# EAGLE design led-strip (EAGLE 9.2.0)
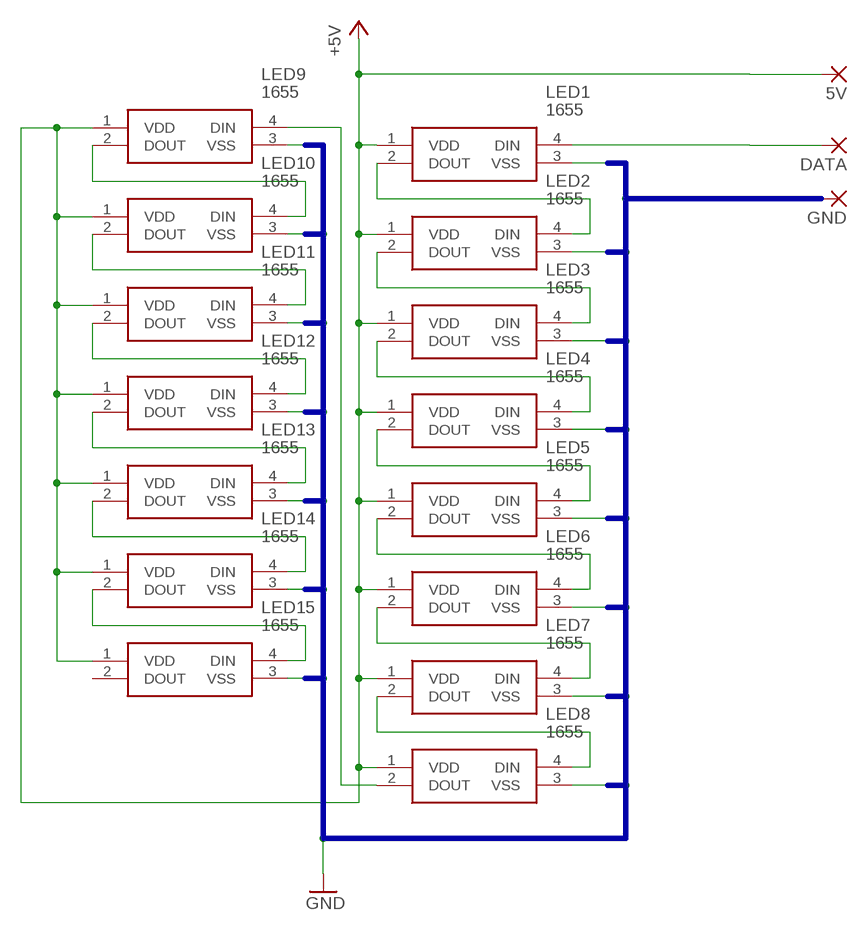
[diagram p0: schematic, sheet 1]

## Parts
5V  1,6/0,8  [1,6/0,8]
DATA  1,6/0,8  [1,6/0,8]
GND  1,6/0,8  [1,6/0,8]
LED1  1655  [WS2812B_1]
LED2  1655  [WS2812B_1]
LED3  1655  [WS2812B_1]
LED4  1655  [WS2812B_1]
LED5  1655  [WS2812B_1]
LED6  1655  [WS2812B_1]
LED7  1655  [WS2812B_1]
LED8  1655  [WS2812B_1]
LED9  1655  [WS2812B_1]
LED10  1655  [WS2812B_1]
LED11  1655  [WS2812B_1]
LED12  1655  [WS2812B_1]
LED13  1655  [WS2812B_1]
LED14  1655  [WS2812B_1]
LED15  1655  [WS2812B_1]

## Nets
+5V: 5V.1(P) LED1.1(VDD) LED2.1(VDD) LED3.1(VDD) LED4.1(VDD) LED5.1(VDD) LED6.1(VDD) LED7.1(VDD) LED8.1(VDD) LED9.1(VDD) LED10.1(VDD) LED11.1(VDD) LED12.1(VDD) LED13.1(VDD) LED14.1(VDD) LED15.1(VDD)
DATA-IN: DATA.1(P) LED1.4(DIN)
GND: GND.1(P) LED1.3(VSS) LED2.3(VSS) LED3.3(VSS) LED4.3(VSS) LED5.3(VSS) LED6.3(VSS) LED7.3(VSS) LED8.3(VSS) LED9.3(VSS) LED10.3(VSS) LED11.3(VSS) LED12.3(VSS) LED13.3(VSS) LED14.3(VSS) LED15.3(VSS)
N$1: LED1.2(DOUT) LED2.4(DIN)
N$2: LED2.2(DOUT) LED3.4(DIN)
N$3: LED3.2(DOUT) LED4.4(DIN)
N$4: LED4.2(DOUT) LED5.4(DIN)
N$5: LED5.2(DOUT) LED6.4(DIN)
N$6: LED6.2(DOUT) LED7.4(DIN)
N$7: LED7.2(DOUT) LED8.4(DIN)
N$8: LED8.2(DOUT) LED9.4(DIN)
N$9: LED9.2(DOUT) LED10.4(DIN)
N$10: LED10.2(DOUT) LED11.4(DIN)
N$11: LED11.2(DOUT) LED12.4(DIN)
N$12: LED12.2(DOUT) LED13.4(DIN)
N$13: LED13.2(DOUT) LED14.4(DIN)
N$14: LED14.2(DOUT) LED15.4(DIN)
Unconnected: LED15.2(DOUT)

## Buses
B$1

## Library data of the parts
5V DATA GND = wirepad:1,6/0,8: THROUGH-HOLE PAD
LED1-LED15 = 1655:1655: Intelligent control LED integrated light source, 4-pin SMD Source: Datasheet <http://www.adafruit.com/datasheets/WS2812B.pdf>; ALLIED_NUMBER: 70928826; DESCRIPTION: Intelligent control LED integrated light source, 4-pin SMD; HEIGHT: mm; MANUFACTURER_NAME: Adafruit; MANUFACTURER_PART_NUMBER: 1655

## Board
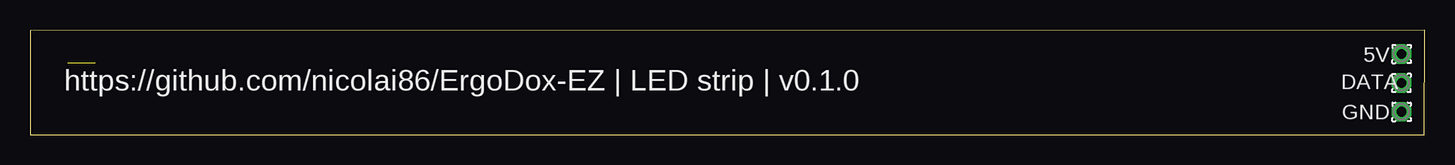
[diagram p1: board, top side]
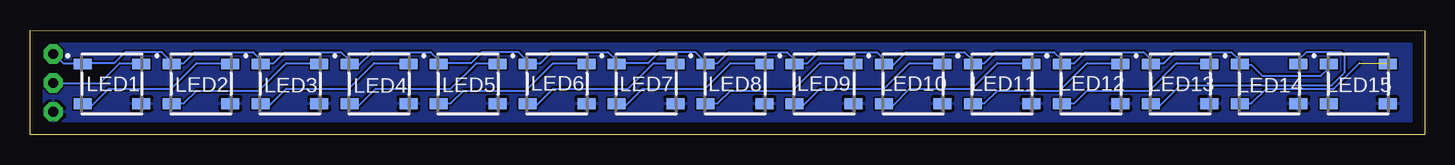
[diagram p2: board, bottom side, seen from below]

Size 116.26 x 8.73 mm. Coordinates in mm from the lower left corner, seen from the top.
Outline: 0,0 0.05,0 116.23,0 116.26,8.73 0,8.65 0,0
Copper layers (1*16): Top 0.035mm / dielectric 1.5mm / Bottom 0.035mm
Design rules "default": minimum track width 6mil, minimum drill 0.35mm, track to track 6mil, track to pad 6mil, pad to pad 6mil, via to via 6mil, smd to smd 6mil, copper to edge 40mil, drill to drill 6mil, minimum pad ring 10mil, minimum via ring 8mil, stop-mask expansion 4mil, vias tented up to drill 0mil, thermal gap 10mil

### Footprints (pad centres in the part's own frame; a part is rotated, then mirrored left to right if it is on the bottom)
1,6/0,8 = drill 0.813 pad 1.6 octagon: 1 0,0
WS2812B_1 = smd 1.5 x 0.9: 1 -2.45,1.65; 2 -2.45,-1.65; 3 2.45,-1.65; 4 2.45,1.65

### Placement (x,y rotation side)
5V  114.33,6.73 90 top
DATA  114.33,4.32 270 top
GND  114.33,1.91 90 top
LED1  109.42,4.24 0 bottom
LED2  102,4.24 0 bottom
LED3  94.58,4.24 0 bottom
LED4  87.16,4.24 0 bottom
LED5  79.74,4.24 0 bottom
LED6  72.32,4.24 0 bottom
LED7  64.9,4.24 0 bottom
LED8  57.48,4.24 0 bottom
LED9  50.06,4.24 0 bottom
LED10  42.64,4.24 0 bottom
LED11  35.22,4.24 0 bottom
LED12  27.8,4.24 0 bottom
LED13  20.38,4.24 0 bottom
LED14  12.96,4.24 0 bottom
LED15  5.54,4.24 0 bottom

### Tracks (layer width: path | path; a pad name or v marks a point on that pad's centre or on a via)
+5V
  Bottom 0.152: 5V.1 114.25,6.73 113.49,5.97 111.96,5.97 LED1.1 111.81,5.97 109.22,5.97 108.31,6.88 105.26,6.88 104.34,5.97 | 104.34,5.97 103.43,5.97 102.51,6.88 97.64,6.88 97.18,6.43 97.18,5.97 LED3.1 97.03,5.97 95.96,5.97 95.05,6.88 90.32,6.88 89.71,6.27 89.71,5.97 LED4.1 89.56,5.82 88.8,5.82 87.73,6.88 82.85,6.88 82.25,6.27 82.25,5.97 LED5.1 82.09,5.97 79.5,5.97 78.59,6.88 75.54,6.88 74.63,5.97 | 104.34,5.97 LED2.1 104.34,5.97 | LED15.1 8.03,5.82 8.03,5.51 8.64,4.9 13.51,4.9 14.43,5.82 15.34,5.82 LED14.1 15.49,5.97 15.49,6.27 16.1,6.88 20.83,6.88 21.74,5.97 22.81,5.97 LED13.1 22.96,5.97 22.96,6.43 23.42,6.88 28.3,6.88 29.21,5.97 30.12,5.97 LED12.1 30.28,5.97 30.28,6.27 30.89,6.88 35.76,6.88 36.68,5.97 37.59,5.97 LED11.1 37.74,5.97 37.74,6.27 38.35,6.88 43.23,6.88 44.3,5.82 45.06,5.82 LED10.1 45.21,5.97 45.21,6.43 45.67,6.88 50.55,6.88 51.46,5.97 52.37,5.97 LED9.1 52.53,5.97 52.53,6.27 53.14,6.88 58.01,6.88 58.93,5.97 59.84,5.97 | 74.63,5.97 73.71,5.97 72.8,6.88 68.07,6.88 67.46,6.27 67.46,5.97 LED7.1 67.31,5.97 64.72,5.97 63.8,6.88 60.76,6.88 59.84,5.97 | 74.63,5.97 LED6.1 74.63,5.97 | 59.84,5.97 LED8.1 59.84,5.97
DATA-IN
  Bottom 0.152: LED1.4 107.09,5.97 108.76,5.97 110.44,4.29 114.25,4.29 DATA.1
GND
  pour Bottom: 0.13,8.53 116.13,8.53 116.13,0.03 0.13,0.03
N$1
  Bottom 0.152: LED2.4 99.62,5.97 102.36,5.97 104.5,3.84 109.68,3.84 111.05,2.46 111.81,2.46 LED1.2
N$2
  Bottom 0.152: LED3.4 92.15,5.97 94.89,5.97 97.18,3.68 102.36,3.68 103.43,2.62 104.34,2.62 LED2.2
N$3
  Bottom 0.152: LED4.4 84.84,5.97 87.58,5.97 89.71,3.84 94.89,3.84 96.27,2.46 97.03,2.46 LED3.2
N$4
  Bottom 0.152: LED5.4 77.37,5.97 79.04,5.97 81.18,3.84 87.43,3.84 88.8,2.46 89.56,2.46 LED4.2
N$5
  Bottom 0.152: LED6.4 69.9,5.97 72.64,5.97 74.93,3.68 80.11,3.68 81.18,2.62 82.09,2.62 LED5.2
N$6
  Bottom 0.152: LED7.4 62.59,5.97 64.26,5.97 66.4,3.84 72.64,3.84 74.02,2.46 74.63,2.46 LED6.2
N$7
  Bottom 0.152: LED8.4 55.12,5.97 57.86,5.97 59.99,3.84 65.18,3.84 66.55,2.46 67.31,2.46 LED7.2
N$8
  Bottom 0.152: LED9.4 47.65,5.97 50.39,5.97 52.68,3.68 57.86,3.68 58.93,2.62 59.84,2.62 LED8.2
N$9
  Bottom 0.152: LED10.4 40.34,5.97 42.93,5.97 45.06,3.84 50.39,3.84 51.77,2.46 52.37,2.46 LED9.2
N$10
  Bottom 0.152: LED11.4 32.87,5.97 35.61,5.97 37.74,3.84 42.93,3.84 44.3,2.46 45.06,2.46 LED10.2
N$11
  Bottom 0.152: LED12.4 25.4,5.97 28.14,5.97 30.43,3.68 35.61,3.68 36.68,2.62 37.59,2.62 LED11.2
N$12
  Bottom 0.152: LED13.4 17.93,5.97 20.68,5.97 22.96,3.68 28.14,3.68 29.21,2.62 30.12,2.62 LED12.2
N$13
  Bottom 0.152: LED14.4 10.46,5.97 10.46,6.27 9.86,6.88 6.96,6.88 6.65,6.58 6.65,5.21 7.72,4.14 20.37,4.14 22.05,2.46 22.81,2.46 LED13.2
N$14  (1 unrouted)
  Bottom 0.152: 5.44,5.97 7.57,3.84 13.21,3.84 14.43,2.62 15.34,2.62 LED14.2 | 3.15,5.97 LED15.4

### Text on the board
tPlace: https://github.com/nicolai86/ErgoDox-EZ | LED strip | v0.1.0